# Altium project Shield_Project.PrjPcb
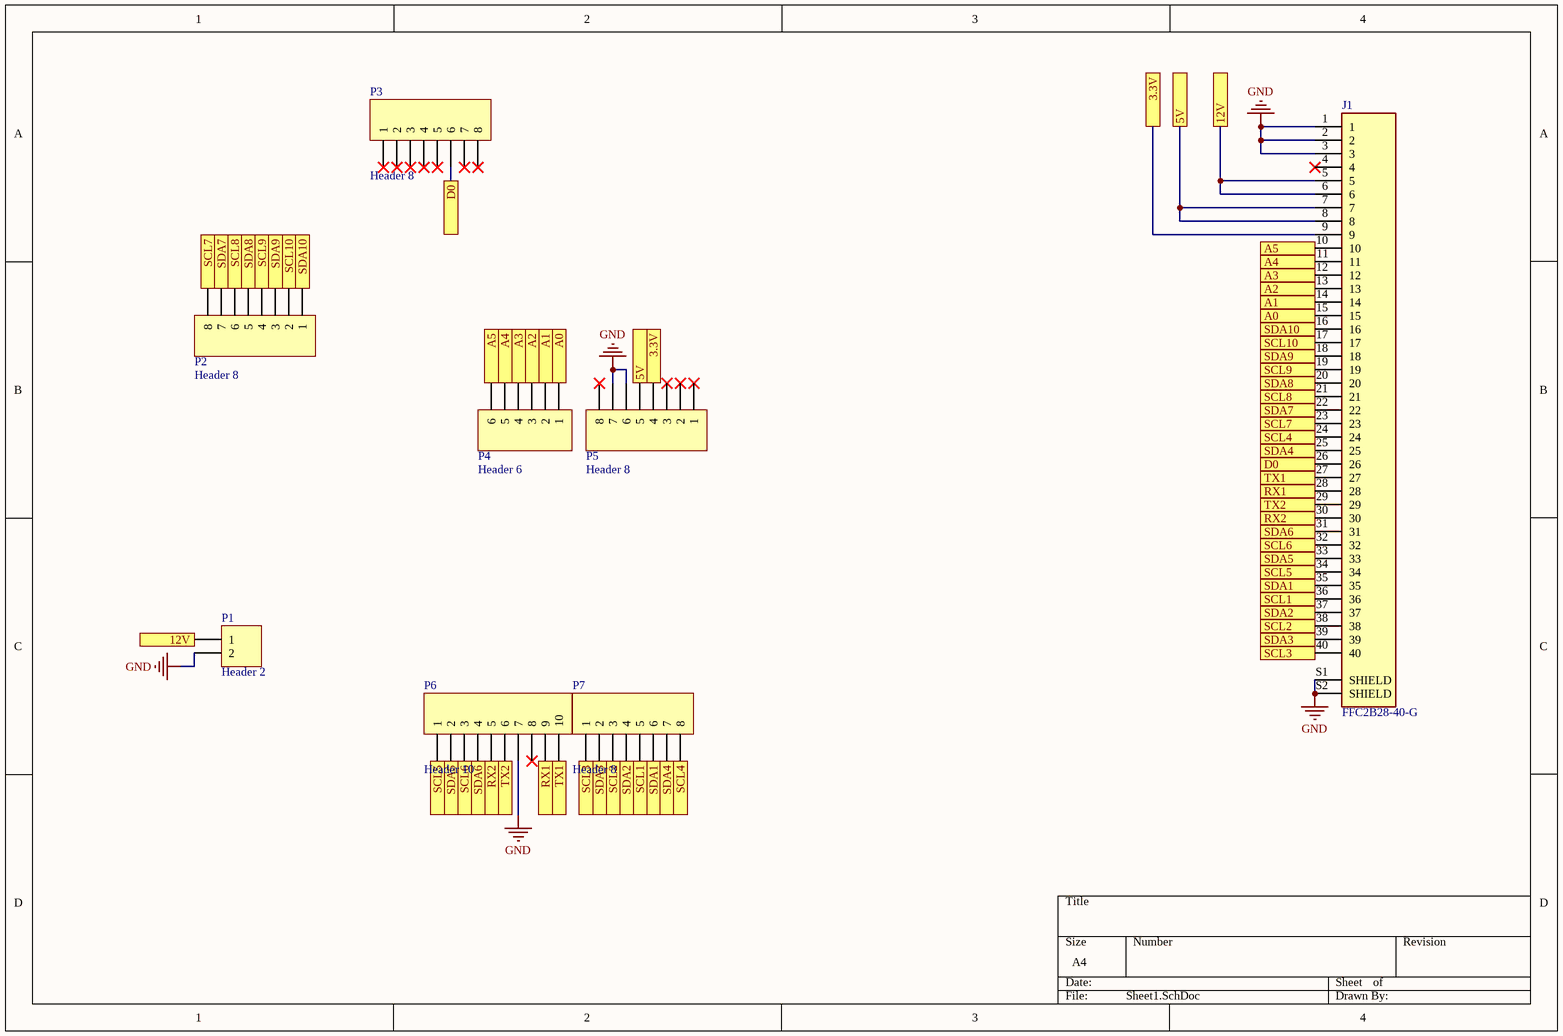
[diagram p0: Sheet1.SchDoc]
1 sheet, 8 parts. Net scope: flat (ports and power ports of the same name join across sheets).
Board file: PCB1.PcbDoc

## Sheet Sheet1.SchDoc
size A4

### Parts
J1  FFC2B28-40-G  [GCT_FFC2B28-40-G]
P1  Header 2  [HDR1X2]
P2  Header 8  [HDR1X8]
P3  Header 8  [HDR1X8]
P4  Header 6  [HDR1X6]
P5  Header 8  [HDR1X8]
P6  Header 10  [HDR1X10]
P7  Header 8  [HDR1X8]

### Ports
3.3V, 5V, 12V, A0, A1, A2, A3, A4, A5, D0, RX1, RX2, SCL1, SCL2, SCL3, SCL4, SCL5, SCL6, SCL7, SCL8, SCL9, SCL10, SDA1, SDA2, SDA3, SDA4, SDA5, SDA6, SDA7, SDA8, SDA9, SDA10, TX1, TX2

### Nets
GND: J1.1 J1.2 J1.3 J1.S1(SHIELD) J1.S2(SHIELD) P1.2 P5.6 P5.7 P6.7
NetJ1_5: J1.5 J1.6 P1.1 ; port 12V
NetJ1_7: J1.7 J1.8 P5.5 ; port 5V
NetJ1_9: J1.9 P5.4 ; port 3.3V
NetJ1_10: J1.10 P4.6 ; port A5
NetJ1_11: J1.11 P4.5 ; port A4
NetJ1_12: J1.12 P4.4 ; port A3
NetJ1_13: J1.13 P4.3 ; port A2
NetJ1_14: J1.14 P4.2 ; port A1
NetJ1_15: J1.15 P4.1 ; port A0
NetJ1_16: J1.16 P2.1 ; port SDA10
NetJ1_17: J1.17 P2.2 ; port SCL10
NetJ1_18: J1.18 P2.3 ; port SDA9
NetJ1_19: J1.19 P2.4 ; port SCL9
NetJ1_20: J1.20 P2.5 ; port SDA8
NetJ1_21: J1.21 P2.6 ; port SCL8
NetJ1_22: J1.22 P2.7 ; port SDA7
NetJ1_23: J1.23 P2.8 ; port SCL7
NetJ1_24: J1.24 P7.8 ; port SCL4
NetJ1_25: J1.25 P7.7 ; port SDA4
NetJ1_26: J1.26 P3.6 ; port D0
NetJ1_27: J1.27 P6.10 ; port TX1
NetJ1_28: J1.28 P6.9 ; port RX1
NetJ1_29: J1.29 P6.6 ; port TX2
NetJ1_30: J1.30 P6.5 ; port RX2
NetJ1_31: J1.31 P6.4 ; port SDA6
NetJ1_32: J1.32 P6.3 ; port SCL6
NetJ1_33: J1.33 P6.2 ; port SDA5
NetJ1_34: J1.34 P6.1 ; port SCL5
NetJ1_35: J1.35 P7.6 ; port SDA1
NetJ1_36: J1.36 P7.5 ; port SCL1
NetJ1_37: J1.37 P7.4 ; port SDA2
NetJ1_38: J1.38 P7.3 ; port SCL2
NetJ1_39: J1.39 P7.2 ; port SDA3
NetJ1_40: J1.40 P7.1 ; port SCL3

Not connected (* = marked no-connect by the designer): J1 4*; P3 1* 2* 3* 4* 5* 7* 8*; P5 1* 2* 3* 8*; P6 8*

### Library data of the parts
J1 = FFC2B28-40-G: 40 Position FFC, FPC Connector Contacts, Top and Bottom 0.020 _0.50mm_ Surface Mount, Right Angle; MF: Global Connector Technology; Value: *; MP: FFC2B28-40-G; Package: Package Analog Devices; Price: None; Availability: Unavailable; SnapEDA_Link: https://www.snapeda.com/parts/FFC2B28-40-G/Global%20Connector%20Technology/view-part/4223068/?ref=snap
P1 = Header 2: Header, 2-Pin; LatestRevisionDate: 17-Jul-2002; LatestRevisionNote: Re-released for DXP Platform.; Publisher: Altium Limited
P2 P3 P5 P7 = Header 8: Header, 8-Pin; LatestRevisionDate: 17-Jul-2002; LatestRevisionNote: Re-released for DXP Platform.; Publisher: Altium Limited
P4 = Header 6: Header, 6-Pin; LatestRevisionDate: 17-Jul-2002; LatestRevisionNote: Re-released for DXP Platform.; Publisher: Altium Limited
P6 = Header 10: Header, 10-Pin; LatestRevisionDate: 17-Jul-2002; LatestRevisionNote: Re-released for DXP Platform.; Publisher: Altium Limited